# EasyEDA Pro project 遥控器PCB设计.eprj, schematic 接收器V2_一体式_自平衡
Board Name: 接收器V2_一体式_自平衡; Create Date: 2025-10-01; Page Name: P1; Project Name: 遥控器PCB设计; Schematic Name: 接收器V2_一体式_自平衡; Update Date: 2025-11-16; Company: 嘉立创EDA; Page Size: A4; Version: V1.0
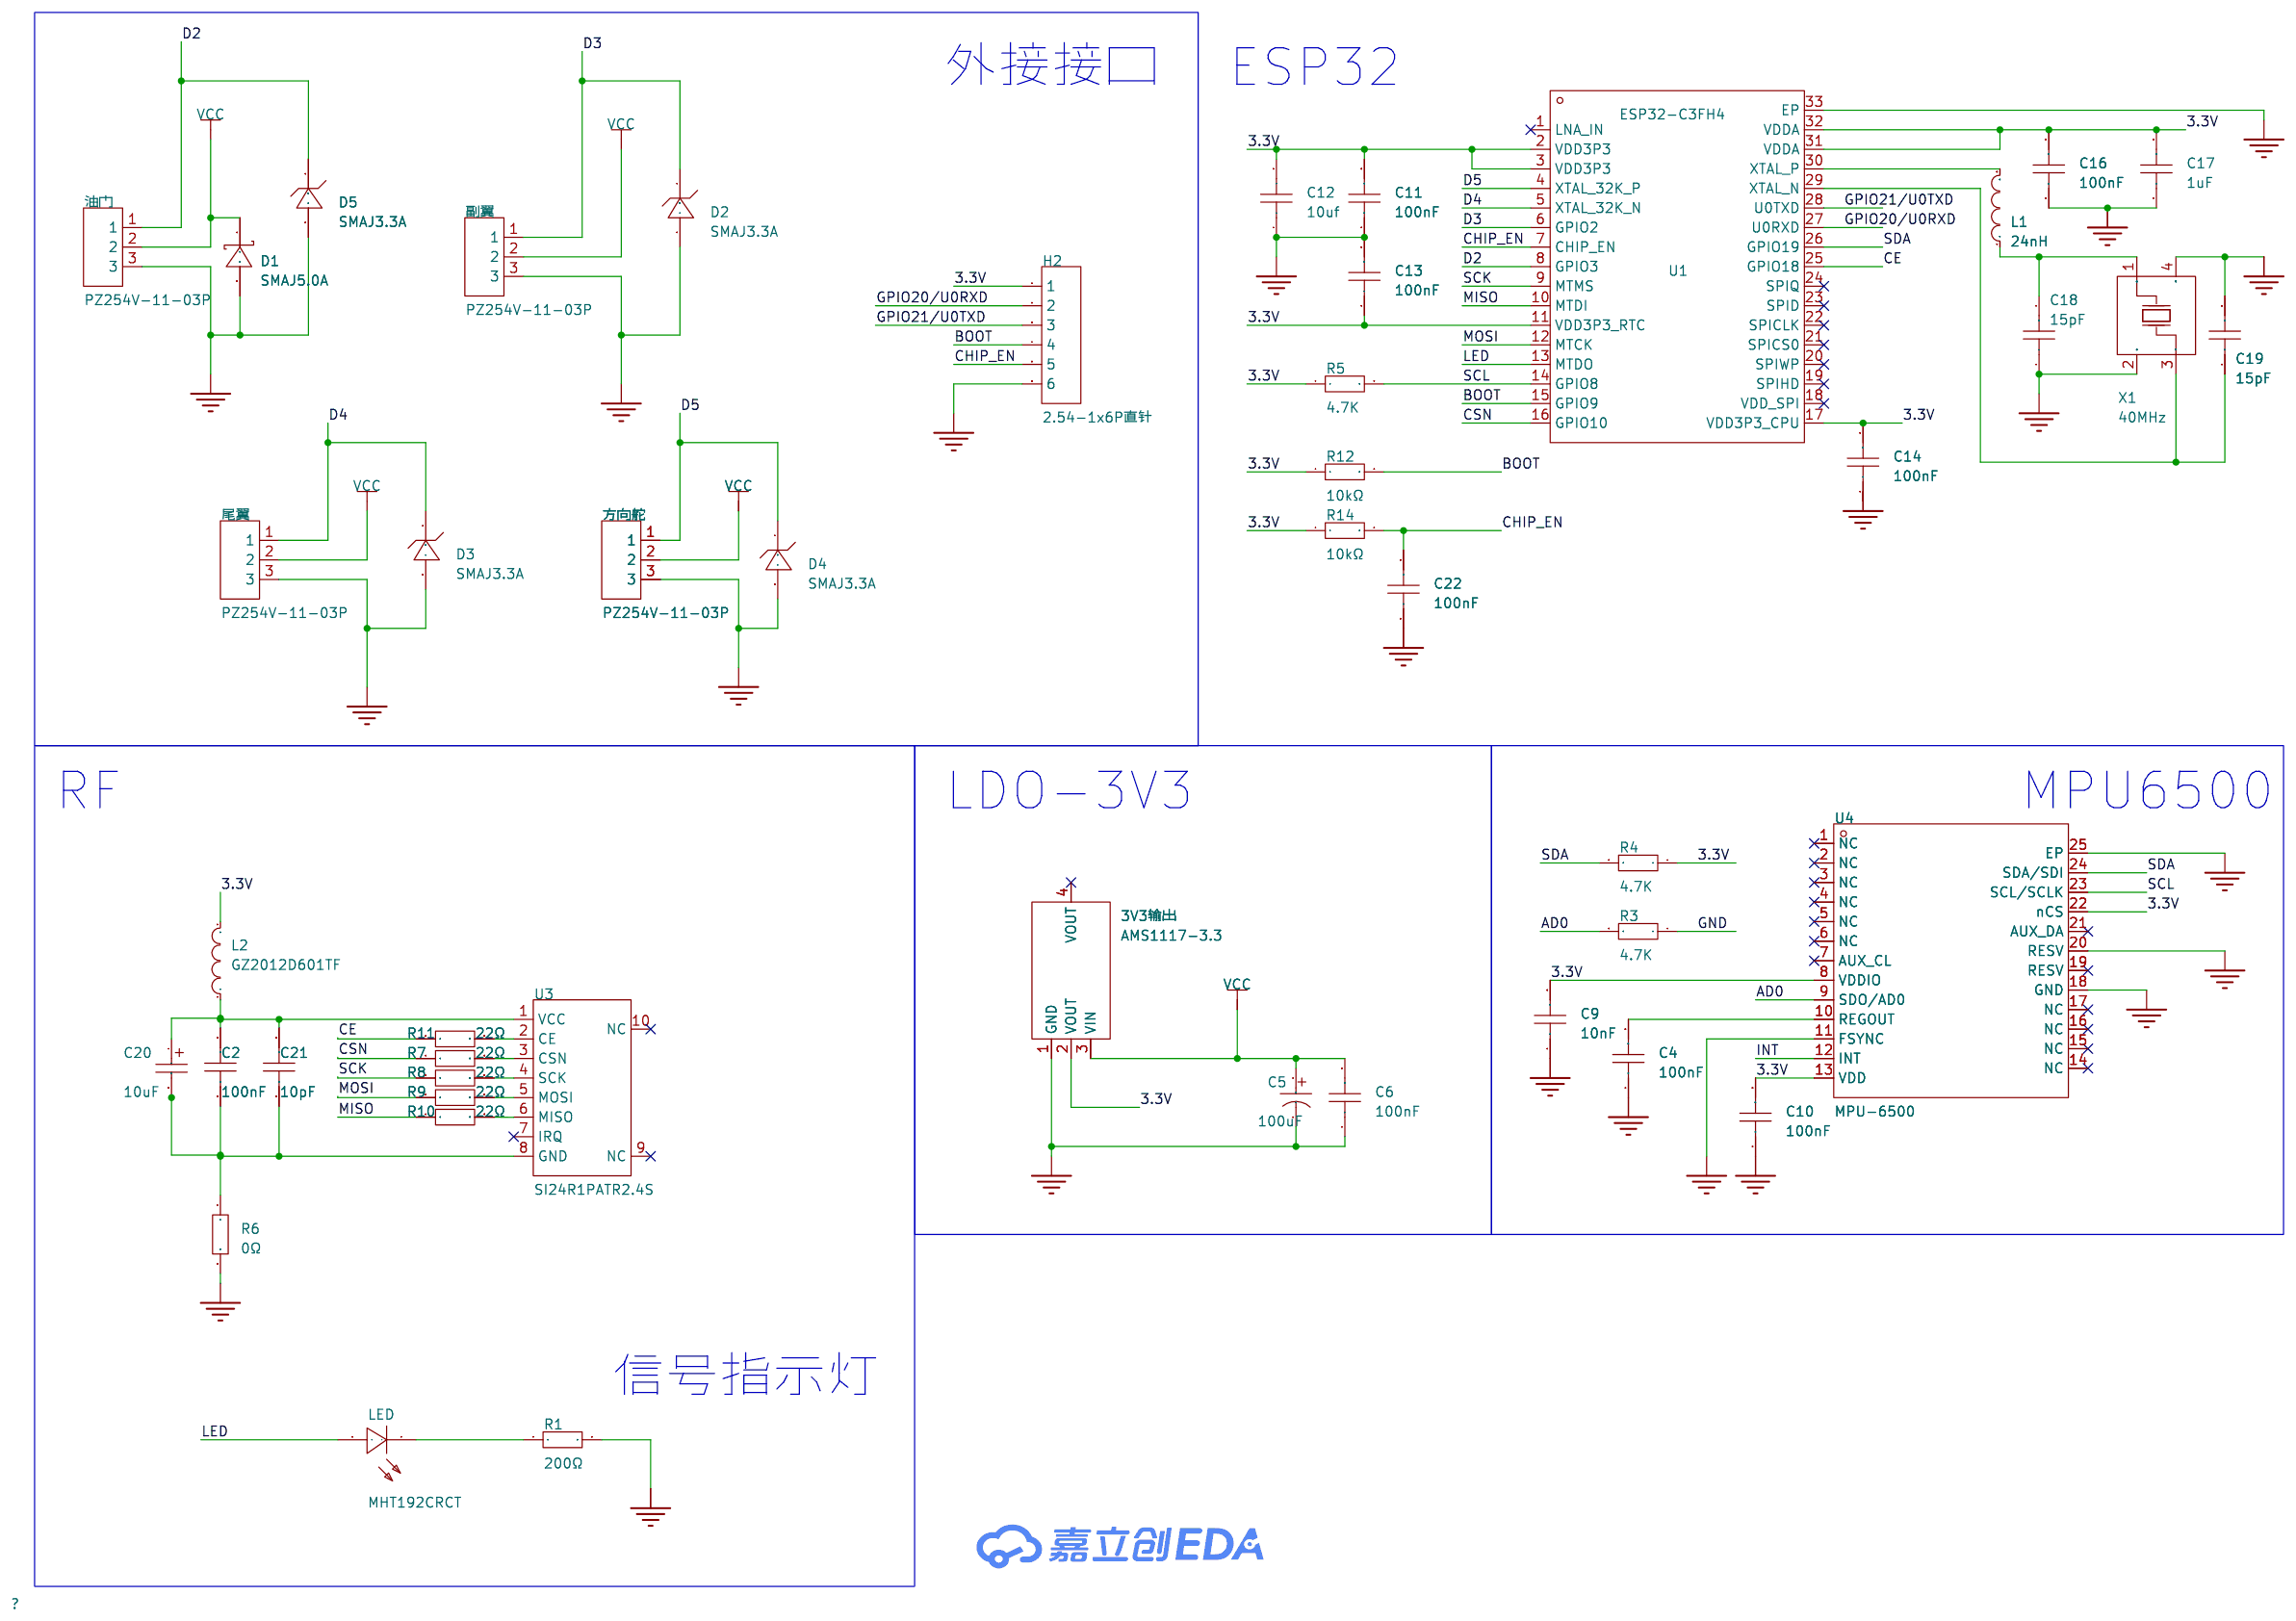
[diagram p11: schematic sheet]

## Parts
3V3输出  AMS1117-3.3  [SOT-223-3_L6.5-W3.4-P2.30-LS7.0-BR]
C2  100nF  [C0603]
C4  100nF  [CAP_0603]
C5  100uF  [CAP-SMD_BD6.3-L6.6-W6.6-FD]
C6  100nF  [C0603]
C9  10nF  [CAP_0603]
C10  100nF  [CAP_0603]
C11  100nF  [C0603]
C12  10uf  [C0603]
C13  100nF  [C0603]
C14  100nF  [C0603]
C16  100nF  [C0603]
C17  1uF  [C0603]
C18  15pF  [C0603]
C19  15pF  [C0603]
C20  10uF  [CAP-SMD_L3.2-W1.6-RD]
C21  10pF  [C0603]
C22  100nF  [C0603]
D1  SMAJ5.0A  [SMA_L4.4-W2.6-LS5.0-RD]
D2  SMAJ3.3A  [SMA_L4.3-W2.7-LS5.1-RD]
D3  SMAJ3.3A  [SMA_L4.3-W2.7-LS5.1-RD]
D4  SMAJ3.3A  [SMA_L4.3-W2.7-LS5.1-RD]
D5  SMAJ3.3A  [SMA_L4.3-W2.7-LS5.1-RD]
H2  2.54-1x6P直针  [HDR-TH_6P-P2.54-V-M-1]
L1  24nH  [L0603]
L2  GZ2012D601TF  [L0805]
LED  MHT192CRCT  [LED0603-RD]
R1  200Ω  [R0603]
R3  4.7K  [RES_0603]
R4  4.7K  [RES_0603]
R5  4.7K  [R0603]
R6  0Ω  [R0603]
R7  22Ω  [R0603]
R8  22Ω  [R0603]
R9  22Ω  [R0603]
R10  22Ω  [R0603]
R11  22Ω  [R0603]
R12  10kΩ  [R0603]
R14  10kΩ  [R0603]
U1  ESP32-C3FH4  [QFN-32_L5.0-W5.0-P0.50-TL-EP3.7]
U3  SI24R1PATR2.4S  [WIRELM-SMD_8P-L19.0-W13.0-P1.27-TL]
U4  MPU-6500  [QFN-24_L3.0-W3.0-P0.40-BL-EP]
X1  40MHz  [OSC-SMD_4P-L3.2-W2.5-BL_SIT8008BI]
副翼  PZ254V-11-03P  [HDR-TH_3P-P2.54-V-M]
尾翼  PZ254V-11-03P  [HDR-TH_3P-P2.54-V-M]
方向舵  PZ254V-11-03P  [HDR-TH_3P-P2.54-V-M]
油门  PZ254V-11-03P  [HDR-TH_3P-P2.54-V-M]

## Library data of the parts
3V3输出 = AMS1117-3.3_C6186: 输出类型:固定;工作电压:-;输出电压:3.3V;输出电流:1A;电源纹波抑制比(PSRR):72dB@(120Hz);输出极性:正极;; LCSC Part Name: 输出3.3V 1A; Supplier Part: C6186; Manufacturer: AMS; Supplier Footprint: SOT-223; JLCPCB Part Class: Basic Part; Datasheet: https://atta.szlcsc.com/upload/public/pdf/source/20180727/C6186_7A095716F0823C02F1997A905E26C086.pdf; Supplier: LCSC; Output Type: 固定; Output Voltage: 3.3V; Output Current: 1A; Power Supply Rejection Ratio (PSRR): 72dB@(120Hz); Voltage Dropout: 1.3V@(800mA); Features: 过流保护(OCP)；热关断(TSD); Output Configuration: 正极; Number of Outputs: 1
C2 C6 C11-C14 C16-C19 C21 C22 = CGA0603X7R104K500JT: 容值:100nF;精度:±10%;额定电压:50V;材质(温度系数):X7R;; LCSC Part Name: 100nF ±10% 50V; Supplier Part: C6119867; Manufacturer: HRE(芯声); Supplier Footprint: 0603; JLCPCB Part Class: 扩展库; Supplier: LCSC; Tolerance: ±10%; Voltage Rated: 50V; Temperature Coefficient: X7R
C4 C9 C10 = CAP_0603: Supplier Footprint: 0603
C5 = RVT2A100M0607_C72482: 容值:10uF;精度:±20%;额定电压:100V;纹波电流:38mA@120Hz;等效串联电阻(ESR):-;; LCSC Part Name: 10uF ±20% 100V; Supplier Part: C72482; Manufacturer: ROQANG(容强); Manufacturer Part: RVT2A100M0607; Supplier Footprint: SMD,D6.3xL7.7mm; JLCPCB Part Class: 扩展库; Datasheet: https://atta.szlcsc.com/upload/public/pdf/source/20170325/1490427950282.pdf; Supplier: LCSC; Tolerance: ±20%; Voltage Rating: 100V; Ripple Current: 38mA@120Hz; Diameter: 6.3mm; Height - Seated (Max): 7.7mm; Lifetime: 2000hrs@105℃; Operating Temperature: -40℃~+105℃
C20 = CA45-A-16V-10uF-K: LCSC Part Name: 10uF ±10% 16V; Supplier Part: C128254; Manufacturer: CEC(振华新云); Supplier Footprint: CASE-A-3216; JLCPCB Part Class: 扩展库; Datasheet: https://atta.szlcsc.com/upload/public/pdf/source/20170914/C128254_1505359752472967905.pdf; Supplier: LCSC; Tolerance: ±10%; Rated Voltage: 16V; Equivalent Series Resistance(ESR): 10Ω@100kHz; Operating Temperature: -55℃~+125℃
D1 = SMAJ5.0A: LCSC Part Name: 单向TVS; Supplier Part: C143135; Manufacturer: FMS(美丽微); Supplier Footprint: SMA(DO-214AC); JLCPCB Part Class: 扩展库; Datasheet: https://item.szlcsc.com/datasheet/SMAJ5.0A/154466.html; Supplier: LCSC; Polarity: 单向; Reverse Stand-Off Voltage (Vrwm): 5V; Clamping Voltage: 9.2V; Peak Pulse Current (Ipp): 43.5A@10/1000us; Peak Pulse Power Dissipation (Ppp): 400W@10/1000us; Voltage - Breakdown: 7V; Reverse Leakage Current (Ir): 800uA; Operating Temperature: -55℃~+150℃; Type: TVS
D2-D5 = SMAJ3.3A: LCSC Part Name: 单向TVS 3.3V截止 25A峰值脉冲; Supplier Part: C2917853; Manufacturer: ZHIDE(志得); Supplier Footprint: SMA; JLCPCB Part Class: 扩展库; Datasheet: https://item.szlcsc.com/datasheet/SMAJ3.3A/3218387.html; Supplier: LCSC; Reverse Stand-Off Voltage (Vrwm): 3.3V; Clamping Voltage: 8.3V; Peak Pulse Current (Ipp): 25A@10/1000us; Peak Pulse Power Dissipation (Ppp): 400W@10/1000us; Voltage - Breakdown: 5.2V; Reverse Leakage Current (Ir): 200uA; Type: TVS
H2 = 2.54-1x6P直针: LCSC Part Name: 1x6P 间距:2.54mm 方针 直插; Supplier Part: C37208; Manufacturer: BOOMELE(博穆精密); Supplier Footprint: 插件,P=2.54mm; JLCPCB Part Class: 扩展库; Datasheet: https://item.szlcsc.com/datasheet/2.54-1x6P%25E7%259B%25B4%25E9%2592%2588/38187.html; Supplier: LCSC; Pin Structure: 1x6P; Pitch: 2.54mm; Circluar Pins/Square Pins: 方针; Mounting Type: 直插; Number of Rows: 单排; Number of Pins: 6P; Current Rating: 3A; Length of Mating Pin: 6mm; Insulation Height: 2.5mm; Length of End Connection Pin: 3mm; Contact Material: 黄铜; Contact Plating: 金; Operating Temperature: -40℃~+105℃; Color: 黑色
L1 = LQM18FN100M00D: LCSC Part Name: 10uH ±20% 50mA 停产; Supplier Part: C86083; Manufacturer: muRata(村田); Supplier Footprint: 0603; JLCPCB Part Class: 扩展库; Datasheet: https://item.szlcsc.com/datasheet/LQM18FN100M00D/87259.html; Supplier: LCSC; Tolerance: ±20%; Current Rating: 50mA; Current - Saturation (Isat): 50mA; DC Resistance(DCR): 1.17Ω; Frequency - Self Resonant: 30MHz
L2 = GZ2012D601TF: LCSC Part Name: 单路 0805磁珠 阻抗600Ω@100MHz; Supplier Part: C1017; Manufacturer: Sunlord(顺络); Supplier Footprint: 0805; JLCPCB Part Class: 基础库; Datasheet: https://atta.szlcsc.com/upload/public/pdf/source/20241120/893429B990C3BA07384E734821D2F218.pdf; Supplier: LCSC; Impedance @ Frequency: 600Ω@100MHz; Tolerance: ±25%; DC Resistance(DCR): 300mΩ; Current Rating: 500mA; Number of Circuits: 1
LED = MHT192CRCT: 发光颜色:红色;功率:60mW;正向电流:5mA;主波长:621.5nm~633.5nm;二极管配置:-;透镜颜色:无色透明透镜;色温:-;发光角度:120°;载带方式:-;工作温度:-40℃~+85℃;; LCSC Part Name: 红灯; Supplier Part: C389517; Manufacturer: MEIHUA(美华); Supplier Footprint: 0603; JLCPCB Part Class: 扩展库; Datasheet: https://atta.szlcsc.com/upload/public/pdf/source/20190515/C389517_475281E0F1091F4CD4C8D85EF0064C5B.pdf; Supplier: LCSC; Emitted Color: 红色; Power Dissipation: 60mW; Forward Current: 5mA; Dominant Wavelength: 621.5nm~633.5nm; Peak Wavelength: 639nm; Lens Color: 无色透明透镜; Viewing Angle: 120°; Operating Temperature: -40℃~+85℃
R1 = 0603WAF1000T5E: 电阻类型:厚膜电阻;阻值:100Ω;精度:±1%;功率:100mW;最大工作电压:75V;温度系数:±200ppm/℃;; LCSC Part Name: 100Ω ±1% 100mW 厚膜电阻; Supplier Part: C22775; Manufacturer: UNI-ROYAL(厚声); Supplier Footprint: 0603; JLCPCB Part Class: 基础库; Datasheet: https://atta.szlcsc.com/upload/public/pdf/source/20200306/C422600_1E6D84923E4A46A82E41ADD87F860B5C.pdf; Supplier: LCSC; Type: 厚膜电阻; Tolerance: ±1%; Power(Watts): 100mW; Overload Voltage (Max): 75V; Temperature Coefficient: ±200ppm/℃; Operating Temperature Range: -55℃~+155℃
R3 R4 = Res_0603: Supplier Footprint: 0603
R5 R12 R14 = 0603WAF1002T5E: LCSC Part Name: 厚膜电阻 10kΩ ±1% 100mW; Supplier Part: C25804; Manufacturer: UNI-ROYAL(厚声); Supplier Footprint: 0603; JLCPCB Part Class: 基础库; Datasheet: https://atta.szlcsc.com/upload/public/pdf/source/20200306/C422600_1E6D84923E4A46A82E41ADD87F860B5C.pdf; Supplier: LCSC; Type: 厚膜电阻; Tolerance: ±1%; Power(Watts): 100mW; Voltage-Supply(Max): 75V; Temperature Coefficient: ±100ppm/℃; Operating Temperature: -55℃~+155℃
R6 = 0603WAF0000T5E: LCSC Part Name: 0Ω ±1% 100mW 厚膜电阻; Supplier Part: C21189; Manufacturer: UNI-ROYAL(厚声); Supplier Footprint: 0603; JLCPCB Part Class: 基础库; Datasheet: https://item.szlcsc.com/datasheet/0603WAF0000T5E/21903.html; Supplier: LCSC; Type: 厚膜电阻; Tolerance: ±1%; Power(Watts): 100mW; Voltage-Supply(Max): 75V; Operating Temperature: -55℃~+155℃
R7-R11 = 0603WAF220JT5E: LCSC Part Name: 22Ω ±1% 100mW 厚膜电阻; Supplier Part: C23345; Manufacturer: UNI-ROYAL(厚声); Supplier Footprint: 0603; JLCPCB Part Class: 基础库; Datasheet: https://atta.szlcsc.com/upload/public/pdf/source/20200306/C422600_1E6D84923E4A46A82E41ADD87F860B5C.pdf; Supplier: LCSC; Type: 厚膜电阻; Tolerance: ±1%; Power(Watts): 100mW; Overload Voltage (Max): 75V; Temperature Coefficient: ±100ppm/℃; Operating Temperature Range: -55℃~+155℃
U1 = ESP32-C3FH4: Supplier Part: C2858491; Manufacturer: ESPRESSIF(乐鑫); Supplier Footprint: QFN-32; JLCPCB Part Class: Extended Part; Datasheet: https://atta.szlcsc.com/upload/public/pdf/source/20210726/B8823F05EB5B1ECA99D4F01661A43FA8.pdf; Supplier: LCSC
U3 = SI24R1PATR2.4S: Supplier Part: C42381997; Manufacturer: Silicontra(硅传科技); Supplier Footprint: SMD,19x13mm; Datasheet: https://atta.szlcsc.com/upload/public/pdf/source/20241115/809FD1A56325C6B6F40BD1CE26774ACD.pdf; Supplier: LCSC
U4 = MPU-6500_C50278: Supplier Part: C50278; Manufacturer: TDK InvenSense(应美盛); Supplier Footprint: QFN-24-EP(3x3); JLCPCB Part Class: 扩展库; Datasheet: https://item.szlcsc.com/datasheet/MPU-6500/51287.html; Supplier: LCSC; Sensor Type: 加速度计陀螺仪; Operating Temperature: -40℃~+85℃
X1 = X322540MPB4SI: LCSC Part Name: YSX321SL 40MHZ 4P 3225 15PF ±10PPM -40~85℃ (±20PPM); Supplier Part: C9010; Manufacturer: YXC(扬兴晶振); Supplier Footprint: SMD3225-4P; JLCPCB Part Class: 扩展库; Datasheet: https://item.szlcsc.com/datasheet/X322540MPB4SI/9530.html; Supplier: LCSC; Type: 贴片晶振; Normal temperature Frequency Tolerance: ±10ppm; Load Capacitance: 15pF; Frequency Stability: ±20ppm; Operating Temperature: -40℃~+85℃
副翼 尾翼 方向舵 油门 = PZ254V-11-03P: 插针结构:1x3P;间距:2.54mm;行距:-;圆针/方针:方针;安装方式:直插;排数:单排;总PIN位数:3P;额定电流:3A;额定电压:250V;配合针长度:6mm;塑高:2.5mm;端接针长度:3mm;工作温度:-40℃~+105℃;颜色:黑色;; LCSC Part Name: 1x3P 间距:2.54mm 方针 直插; Supplier Part: C2937625; Manufacturer: XFCN(兴飞); Supplier Footprint: 插件,P=2.54mm; JLCPCB Part Class: 扩展库; Datasheet: https://atta.szlcsc.com/upload/public/pdf/source/20200309/C492402_8335C3D49C4E4C618838D59BB1D024C1.pdf; Supplier: LCSC; Pin Structure: 1x3P; Pitch: 2.54mm; Circluar Pins/Square Pins: 方针; Mounting Type: 直插; Number of Rows: 单排; Number of Pins: 3P; Current Rating: 3A; Voltage Rating (Max): 250V; Length of Mating Pin: 6mm; Insulation Height: 2.5mm; Length of End Connection Pin: 3mm; Operating Temperature: -40℃~+105℃; Color: 黑色

## Nets
3.3V: 3V3输出.2(VOUT) C9.2 C10.2 C11.2 C12.2 C13.1 C14.2 C16.2 C17.2 H2.1 L2.2 R4.1 R5.1 R12.1 R14.1 U1.2(VDD3P3) U1.3(VDD3P3) U1.11(VDD3P3_RTC) U1.17(VDD3P3_CPU) U1.31(VDDA) U1.32(VDDA) U4.8(VDDIO) U4.13(VDD) U4.22(nCS)
GND: 3V3输出.1(GND) C4.1 C5.2 C6.1 C9.1 C10.1 C11.1 C12.1 C13.2 C14.1 C16.1 C17.1 C18.1 C19.2 C22.2 D1.2(A) D2.2(A) D3.2(A) D4.2(A) D5.2(A) H2.6 R1.2 R3.1 R6.2 U1.33(EP) U4.11(FSYNC) U4.18(GND) U4.20(RESV) U4.25(EP) X1.2(GND) X1.4(GND) 副翼.3 尾翼.3 方向舵.3 油门.3
VCC: 3V3输出.3(VIN) C5.1 C6.2 D1.1(K) 副翼.2 尾翼.2 方向舵.2 油门.2
AD0: R3.2 U4.9(SDO/AD0)
BOOT: H2.4 R12.2 U1.15(GPIO9)
CE: R11.1 U1.25(GPIO18)
CHIP_EN: C22.1 H2.5 R14.2 U1.7(CHIP_EN)
CSN: R7.1 U1.16(GPIO10)
D2: D5.1(C) U1.8(GPIO3) 油门.1
D3: D2.1(C) U1.6(GPIO2) 副翼.1
D4: D3.1(C) U1.5(XTAL_32K_N) 尾翼.1
D5: D4.1(C) U1.4(XTAL_32K_P) 方向舵.1
GPIO20/U0RXD: H2.2 U1.27(U0RXD)
GPIO21/U0TXD: H2.3 U1.28(U0TXD)
INT: U4.12(INT)
LED: LED.2(+) U1.13(MTDO)
MISO: R10.1 U1.10(MTDI)
MOSI: R9.1 U1.12(MTCK)
SCK: R8.1 U1.9(MTMS)
SCL: R5.2 U1.14(GPIO8) U4.23(SCL/SCLK)
SDA: R4.2 U1.26(GPIO19) U4.24(SDA/SDI)
$1N1088: LED.1(-) R1.1
$1N3295: C4.2 U4.10(REGOUT)
$1N4208: C2.1 C20.2 C21.1 R6.1 U3.8(GND)
$1N4209: C2.2 C20.1 C21.2 L2.1 U3.1(VCC)
$1N6331: C19.1 U1.29(XTAL_N) X1.3(OSC2)
$1N6574: C18.2 L1.1 X1.1(OSC1)
$1N6577: L1.2 U1.30(XTAL_P)
$1N8224: R7.2 U3.3(CSN)
$1N8268: R8.2 U3.4(SCK)
$1N8312: R9.2 U3.5(MOSI)
$1N8406: R11.2 U3.2(CE)

Not connected (* = marked no-connect by the designer): 3V3输出 4(VOUT)*; R10 2; U1 1(LNA_IN)* 18(VDD_SPI)* 19(SPIHD)* 20(SPIWP)* 21(SPICS0)* 22(SPICLK)* 23(SPID)* 24(SPIQ)*; U3 6(MISO) 7(IRQ)* 9(NC)* 10(NC)*; U4 1(NC)* 2(NC)* 3(NC)* 4(NC)* 5(NC)* 6(NC)* 7(AUX_CL)* 14(NC)* 15(NC)* 16(NC)* 17(NC)* 19(RESV)* 21(AUX_DA)*

## Notes on the sheet
- 外接接口
- ESP32
- RF
- LDO-3V3
- MPU6500
- 信号指示灯
